# EAGLE design SSR v0.9b (EAGLE 6.1)
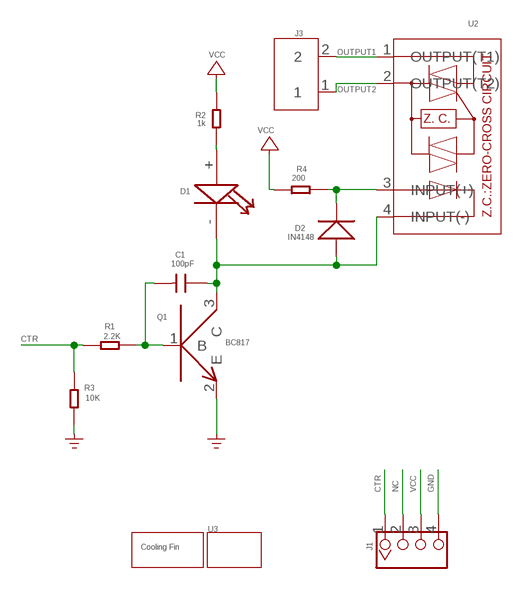
[diagram p0: schematic, sheet 1]

## Parts
C1  100pF  C-0603  [0603]
D1  LED0805  [LED0805]
D2  IN4148  D1N4148-SMD  [DO-35-SMD]
J1  TWIG-4P-2.0-2.0  [4P-2.0]
J3  SCREW-TERMINAL-2P5.0  [2P-5.0]
Q1  NPN_9013  [SOT23]
R1  2.2K  R-0603  [0603]
R2  1k  R-0603  [0603]
R3  10K  R-0603  [0603]
R4  200  R-0603  [0603]
U1  SILK-COOLING-FIN  [COOLING-FIN-30X25]
U2  RELAY-S208T02  [4P-23X4X16H]
U3  TWIG-2X2U  [2X2U-DIM-W/-DRILL]

## Nets
CTR: J1.1 R1.1 R3.2
GND: J1.4 Q1.2(E) R3.1
N$1: D2.C(-) R4.2 U2.3(INPUT(+))
N$2: C1.2 Q1.1(B) R1.2
N$3: C1.1 D1.- D2.A(+) Q1.3(C) U2.4(INPUT(-))
N$6: D1.+ R2.1
NC: J1.2
OUTPUT1: J3.2 U2.1(OUTPUT(T1))
OUTPUT2: J3.1 U2.2(OUTPUT(T2))
VCC: J1.3 R2.2 R4.1 ; supply symbol labelled POWER_ARROW

## Notes on the sheet
- BC817

## Library data of the parts
C1 = Discrete:C*: Ceramic Capacitors
D1 = CPT_SMD:LED0805
D2 = Discrete:D*
J1 = Connector:TWIG-4P-2.0
J3 = Connector:SCREW-TERMINAL-2P
Q1 = CPT_SMD:NPN_9013
R1-R4 = Discrete:R*
U1 = Module:SILK-COOLING-FIN
U2 = Discrete:RELAY-S208T02: LOW Profile Type Solid State Relays
U3 = Module:TWIG

## Board
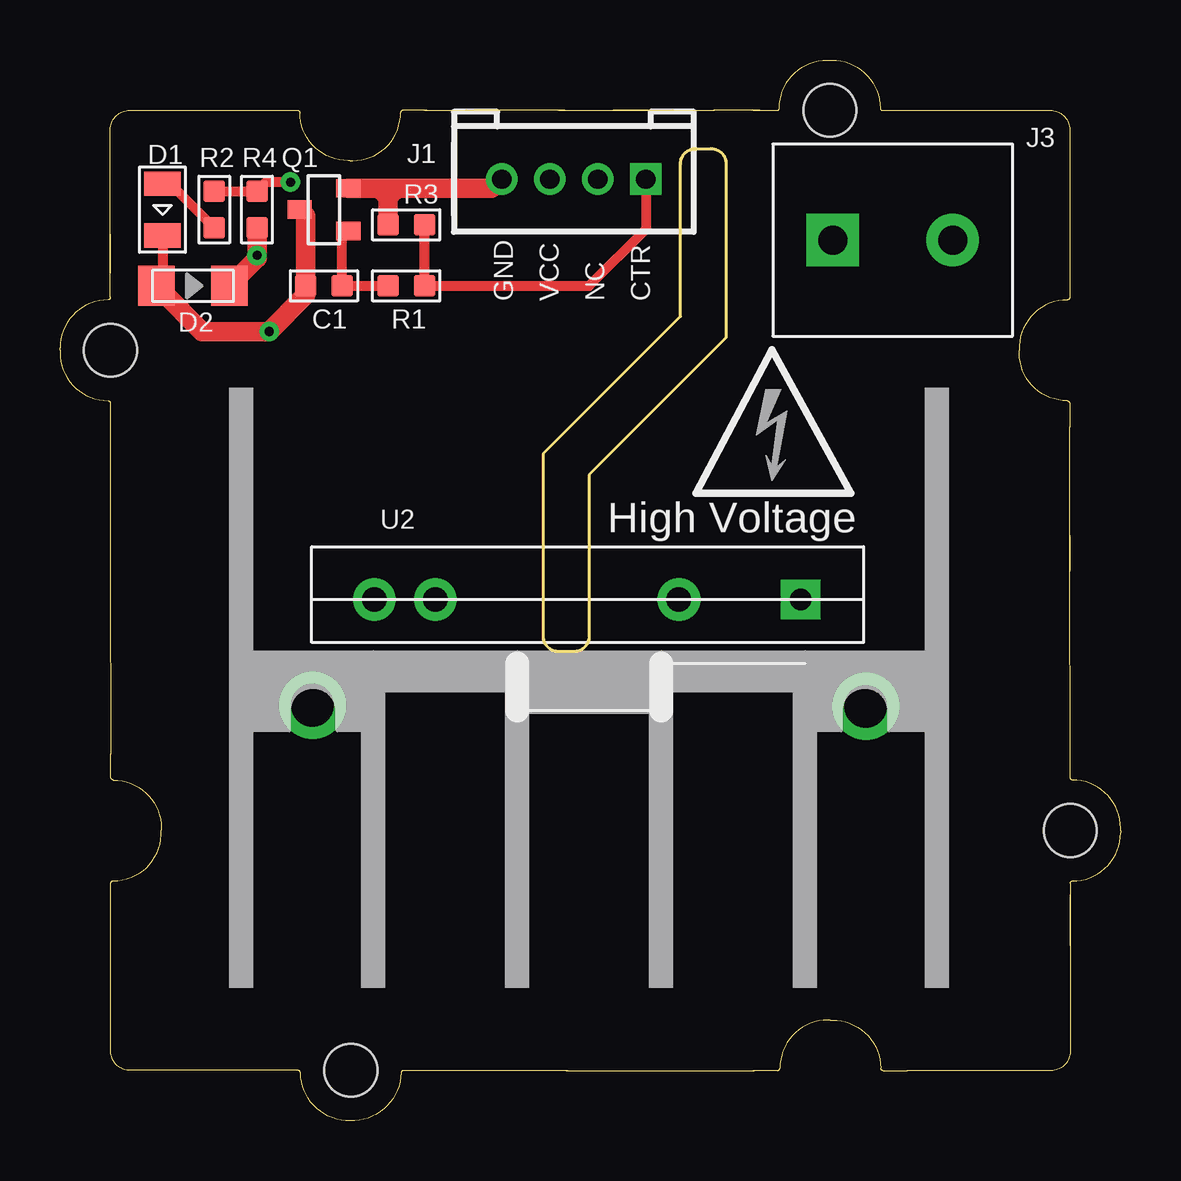
[diagram p1: board, top side]
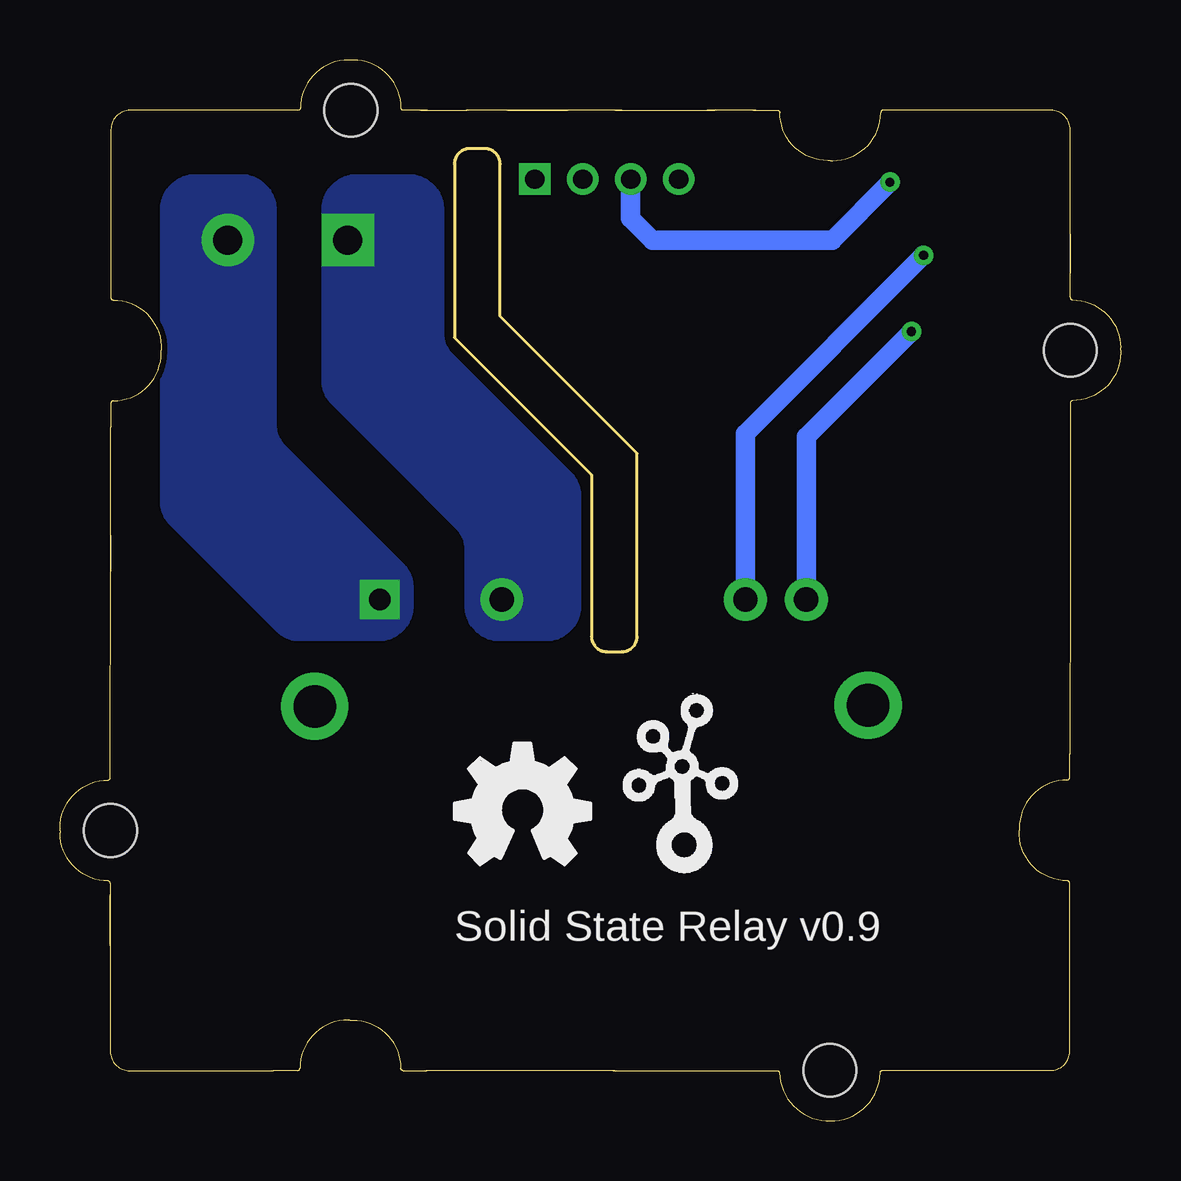
[diagram p2: board, bottom side, seen from below]

Size 44.21 x 44.2 mm. Coordinates in mm from the lower left corner, seen from the top.
Outline: 21.42,19.55 20.79,19.55 arc-90 20.15,20.18 20.15,27.8 25.87,33.52 25.87,39.87 arc-90 26.5,40.5 27.14,40.5 arc-90 27.77,39.87 27.77,32.63 22.05,26.92 22.05,20.18 arc-90 21.42,19.55
Copper layers (1*16): Top 0.035mm / dielectric 1.5mm / Bottom 0.035mm
Design rules: minimum track width 10mil, minimum drill 12mil, track to track 8mil, track to pad 8mil, pad to pad 8mil, via to via 8mil, smd to smd 8mil, copper to edge 10mil, drill to drill 8mil, minimum pad ring 10mil, minimum via ring 8mil, stop-mask expansion 4mil, vias tented up to drill 100mil, thermal gap 10mil

### Footprints (pad centres in the part's own frame; a part is rotated, then mirrored left to right if it is on the bottom)
0603 = smd 0.889 x 0.889: 1 -0.762,0; 2 0.762,0
LED0805 = smd 1.016 x 1.524: + -1.077,0; - 1.077,0
DO-35-SMD = smd 1.524 x 1.676: A 1.524,0; C -1.524,0
4P-2.0 = drill 0.8 pad 1.27 square: 1 -3,0 | drill 0.8 pad 1.27: 2 -1,0; 3 1,0; 4 3,0
2P-5.0 = drill 1.2 pad 2.184 square: 1 0,0 | drill 1.2 pad 2.184: 2 5,0
SOT23 = smd 0.762 x 1.016: 1 -0.889,-1.016; 2 0.889,-1.016; 3 0,1.016
COOLING-FIN-30X25 = drill 1.778 pad 2.794: 1 -11.532,2.286; 2 11.532,2.235
4P-23X4X16H = drill 0.9 pad 1.651 square: 1 -8.88,0.2 | drill 1.016 pad 1.778: 2 -3.8,0.2; 3 6.36,0.2; 4 8.9,0.2
2X2U-DIM-W/-DRILL = hole 2.2: 10.033,20.01; -19.955,10.015; -9.933,-19.99; 20.055,-9.995

### Placement (x,y rotation side)
C1  11.01,34.79 0 top
D1  4.27,37.97 270 top
D2  5.55,34.79 180 top
J1  21.42,39.23 180 top
J3  32.22,36.7 0 top
Q1  11.01,37.97 90 top
R1  14.44,34.79 180 top
R2  6.43,37.97 90 top
R3  14.44,37.33 0 top
R4  8.21,37.97 270 top
U1  22.05,19.55 180 top
U2  22,21.92 180 top
U3  22.05,22.09 0 top
U$1  [TWIGLOGO]  18.25,11.29 0 bottom
U$2  [OSHW_FILLX200_NOTEXT]  27.77,10.66 0 bottom

### Tracks (layer width: path | path; a pad name or v marks a point on that pad's centre or on a via)
CTR
  Top 0.406: J1.1 24.42,37.16 22.05,34.79 R1.1 R3.2
GND
  Top 0.813: J1.4 18.37,39.23 17.99,38.85 13.42,38.85 | 13.42,38.85 Q1.2 | R3.1 13.67,38.6 | 13.67,38.6 13.42,38.85 | 13.67,38.6 13.8,38.6 13.93,38.73 | 13.67,38.6 13.55,38.6 13.42,38.73
N$1  (via drill 0.38 pad 0.81)
  Top 0.813: R4.2 8.21,36.7 v8.21,36.06 8.21,35.93 D2.C
  Bottom 0.813: U2.3 15.64,28.63 v8.21,36.06
N$2
  Top 0.406: Q1.1 11.77,36.82 C1.2 R1.2
N$3  (via drill 0.38 pad 0.81)
  Top 0.406: D1.- 4.27,35.04 D2.A
  Top 0.813: 4.27,35.04 4.27,34.54 5.93,32.89 v8.72,32.89 10.24,34.41 C1.1 10.24,37.71 Q1.3
  Bottom 0.813: U2.4 13.1,28.51 v8.72,32.89
N$6
  Top 0.406: R2.1 4.78,38.85 4.46,38.85 D1.+
OUTPUT1
  pour Bottom (isolate 0.254, no thermals): 30.95,20.18 34.19,20.18 arc45 35.09,20.56 39.46,24.93 arc45 39.84,25.83 39.84,37.97 arc90 38.56,39.23 36.66,39.23 arc90 35.39,37.97 35.39,28.97 arc-45 35.02,28.07 30.05,23.1 arc45 29.68,22.2 29.68,21.46 arc90
OUTPUT2
  pour Bottom (isolate 0.254, no thermals): 31.83,39.23 29.68,39.23 arc90 28.41,37.97 28.41,32.78 arc-45 28.03,31.88 23.06,26.91 arc45 22.69,26.01 22.69,21.46 arc90 23.96,20.18 25.87,20.18 arc90 27.14,21.46 27.14,23.85 arc-45 27.51,24.75 32.73,29.97 arc45 33.1,30.87 33.1,37.97 arc90
VCC  (via drill 0.38 pad 0.81)
  Top 0.406: R2.2 R4.1 8.59,39.11 v9.61,39.11
  Bottom 0.813: J1.3 20.42,37.6 19.52,36.7 12.02,36.7 v9.61,39.11

### Text on the board
tPlace: GND | VCC | NC | CTR | High Voltage
bPlace: Solid State Relay v0.9